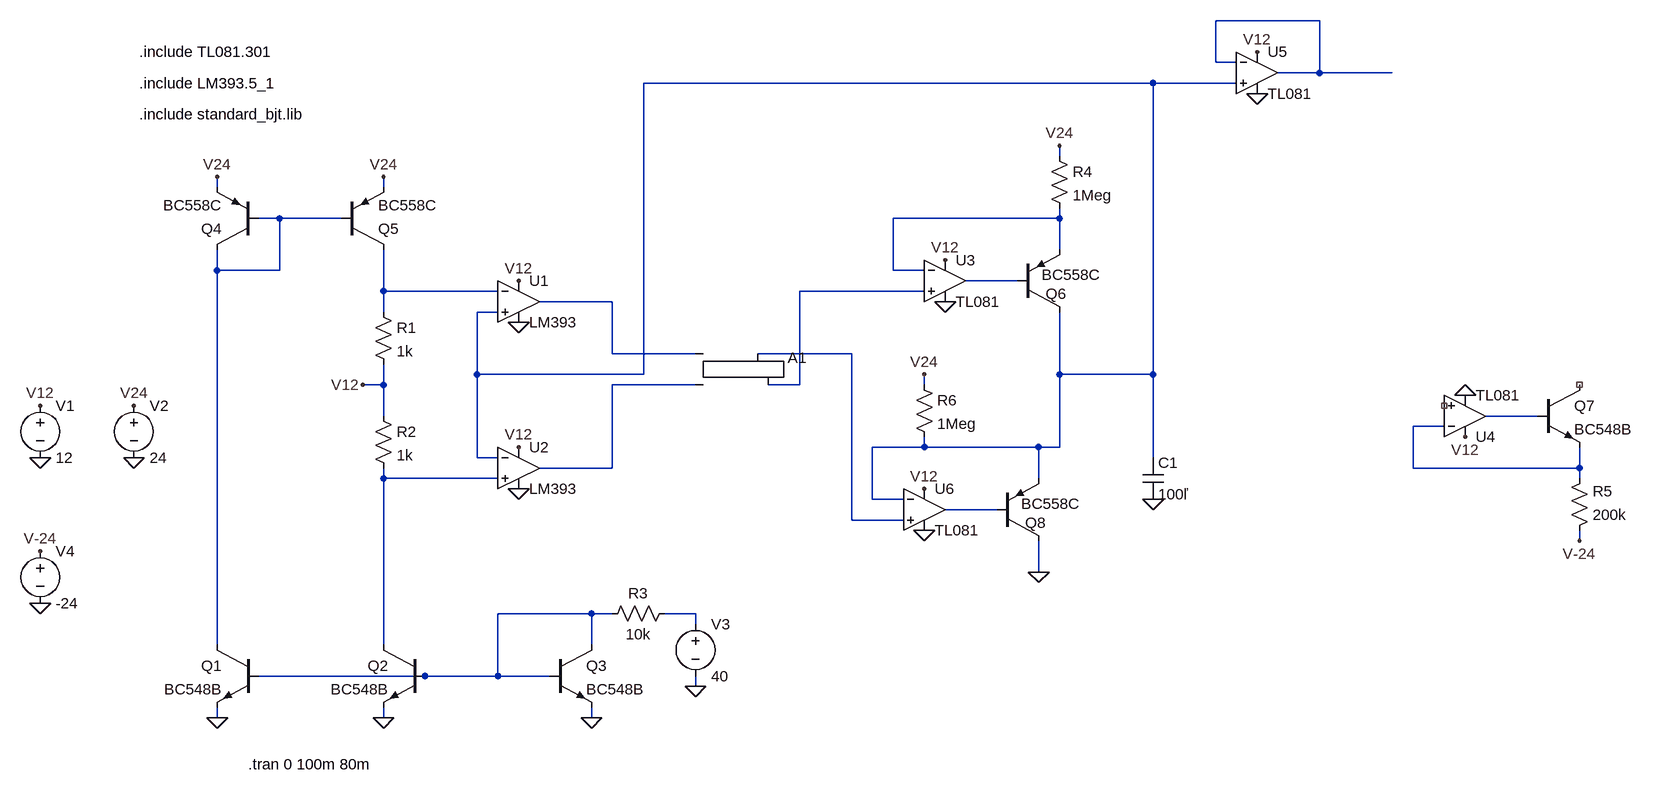
[diagram p0: schematic Gen_triangular_prueba1.asc]
Gen_triangular_prueba1.asc, the LTspice schematic file:
Version 4
SHEET 1 2312 680
WIRE 1824 -688 1664 -688
WIRE 1664 -624 1664 -688
WIRE 1696 -624 1664 -624
WIRE 1824 -608 1824 -688
WIRE 1824 -608 1760 -608
WIRE 1936 -608 1824 -608
WIRE 1568 -592 784 -592
WIRE 1696 -592 1568 -592
WIRE 1424 -480 1424 -496
WIRE 128 -432 128 -448
WIRE 384 -432 384 -448
WIRE 224 -384 192 -384
WIRE 320 -384 224 -384
WIRE 1424 -384 1424 -400
WIRE 1424 -384 1168 -384
WIRE 1424 -336 1424 -384
WIRE 128 -304 128 -336
WIRE 224 -304 224 -384
WIRE 224 -304 128 -304
WIRE 1168 -304 1168 -384
WIRE 1216 -304 1168 -304
WIRE 1360 -288 1280 -288
WIRE 384 -272 384 -336
WIRE 560 -272 384 -272
WIRE 1216 -272 1024 -272
WIRE 736 -256 624 -256
WIRE 384 -240 384 -272
WIRE 560 -240 528 -240
WIRE 736 -176 736 -256
WIRE 864 -176 736 -176
WIRE 1104 -176 960 -176
WIRE 528 -144 528 -240
WIRE 784 -144 784 -592
WIRE 784 -144 528 -144
WIRE 1424 -144 1424 -240
WIRE 1568 -144 1568 -592
WIRE 1568 -144 1424 -144
WIRE 384 -128 384 -160
WIRE 384 -128 352 -128
WIRE 864 -128 736 -128
WIRE 1024 -128 1024 -272
WIRE 1024 -128 976 -128
WIRE 1216 -128 1216 -144
WIRE 384 -80 384 -128
WIRE 2160 -80 2080 -80
WIRE 2016 -64 1968 -64
WIRE 1216 -32 1216 -48
WIRE 1216 -32 1136 -32
WIRE 1392 -32 1216 -32
WIRE 1424 -32 1424 -144
WIRE 1424 -32 1392 -32
WIRE 528 -16 528 -144
WIRE 560 -16 528 -16
WIRE 1568 -16 1568 -144
WIRE 736 0 736 -128
WIRE 736 0 624 0
WIRE 1968 0 1968 -64
WIRE 2224 0 2224 -32
WIRE 2224 0 1968 0
WIRE 384 16 384 0
WIRE 560 16 384 16
WIRE 1392 16 1392 -32
WIRE 2224 16 2224 0
WIRE 1136 48 1136 -32
WIRE 1184 48 1136 48
WIRE 1328 64 1248 64
WIRE 1104 80 1104 -176
WIRE 1184 80 1104 80
WIRE 2224 112 2224 96
WIRE 1392 160 1392 112
WIRE 704 224 560 224
WIRE 736 224 704 224
WIRE 864 224 816 224
WIRE 864 240 864 224
WIRE 128 272 128 -304
WIRE 384 272 384 16
WIRE 704 272 704 224
WIRE 448 320 192 320
WIRE 560 320 560 224
WIRE 560 320 448 320
WIRE 640 320 560 320
WIRE 864 336 864 320
WIRE 128 384 128 368
WIRE 384 384 384 368
WIRE 704 384 704 368
FLAG 704 384 0
FLAG 384 384 0
FLAG 128 384 0
FLAG 864 336 0
FLAG -144 -16 0
FLAG 0 -16 0
FLAG 352 -128 V12
FLAG -144 -96 V12
FLAG 0 -96 V24
FLAG 384 -448 V24
FLAG 128 -448 V24
FLAG 1568 48 0
FLAG 1424 -496 V24
FLAG 2224 112 V-24
FLAG 592 -224 0
FLAG 592 32 0
FLAG 592 -288 V12
FLAG 592 -32 V12
FLAG 1248 -256 0
FLAG 2048 -112 0
FLAG 1728 -576 0
FLAG 1248 -320 V12
FLAG 2048 -48 V12
FLAG 1728 -640 V12
FLAG -144 208 0
FLAG -144 128 V-24
FLAG 1216 -144 V24
FLAG 1216 96 0
FLAG 1216 32 V12
FLAG 1392 160 0
DATAFLAG 528 -272 "$-V(N002)"
DATAFLAG 528 16 "$-V(N002)"
DATAFLAG 1056 -176 ""
DATAFLAG 1008 -128 ""
DATAFLAG 736 -192 ""
DATAFLAG 736 -32 ""
SYMBOL npn 192 272 M0
SYMATTR InstName Q1
SYMATTR Value BC548B
SYMBOL npn 448 272 M0
SYMATTR InstName Q2
SYMATTR Value BC548B
SYMBOL npn 640 272 R0
SYMATTR InstName Q3
SYMATTR Value BC548B
SYMBOL pnp 192 -336 R180
SYMATTR InstName Q4
SYMATTR Value BC558C
SYMBOL pnp 320 -336 M180
SYMATTR InstName Q5
SYMATTR Value BC558C
SYMBOL res 368 -256 R0
SYMATTR InstName R1
SYMATTR Value 1k
SYMBOL res 368 -96 R0
SYMATTR InstName R2
SYMATTR Value 1k
SYMBOL res 832 208 R90
WINDOW 0 0 56 VBottom 2
WINDOW 3 32 56 VTop 2
SYMATTR InstName R3
SYMATTR Value 10k
SYMBOL voltage -144 -112 R0
WINDOW 123 0 0 Left 0
WINDOW 39 0 0 Left 0
SYMATTR InstName V1
SYMATTR Value 12
SYMBOL voltage 0 -112 R0
WINDOW 123 0 0 Left 0
WINDOW 39 0 0 Left 0
SYMATTR InstName V2
SYMATTR Value 24
SYMBOL voltage 864 224 R0
WINDOW 123 0 0 Left 0
WINDOW 39 0 0 Left 0
SYMATTR InstName V3
SYMATTR Value 40
SYMBOL Opamps\\opamp2 592 -320 R0
SYMATTR InstName U1
SYMATTR Value LM393
SYMBOL Opamps\\opamp2 592 -64 R0
SYMATTR InstName U2
SYMATTR Value LM393
SYMBOL Digital\\srflop 912 -224 R0
SYMATTR InstName A1
SYMBOL cap 1552 -16 R0
SYMATTR InstName C1
SYMATTR Value 100ľ
SYMBOL Opamps\\opamp2 1248 -352 R0
SYMATTR InstName U3
SYMATTR Value TL081
SYMBOL Opamps\\opamp2 2048 -16 M180
SYMATTR InstName U4
SYMATTR Value TL081
SYMBOL pnp 1360 -240 M180
WINDOW 0 43 28 Left 2
WINDOW 3 37 57 Left 2
SYMATTR InstName Q6
SYMATTR Value BC558C
SYMBOL res 1408 -496 R0
SYMATTR InstName R4
SYMATTR Value 1Meg
SYMBOL res 2208 112 M180
WINDOW 0 36 76 Left 2
WINDOW 3 36 40 Left 2
SYMATTR InstName R5
SYMATTR Value 200k
SYMBOL npn 2160 -128 R0
SYMATTR InstName Q7
SYMATTR Value BC548B
SYMBOL Opamps\\opamp2 1728 -672 R0
SYMATTR InstName U5
SYMATTR Value TL081
SYMBOL voltage -144 112 R0
WINDOW 123 0 0 Left 0
WINDOW 39 0 0 Left 0
SYMATTR InstName V4
SYMATTR Value -24
SYMBOL Opamps\\opamp2 1216 0 R0
SYMATTR InstName U6
SYMATTR Value TL081
SYMBOL pnp 1328 112 M180
WINDOW 0 43 28 Left 2
WINDOW 3 37 57 Left 2
SYMATTR InstName Q8
SYMATTR Value BC558C
SYMBOL res 1200 -144 R0
SYMATTR InstName R6
SYMATTR Value 1Meg
TEXT 8 -544 Left 2 !.include standard_bjt.lib
TEXT 176 456 Left 2 !.tran 0 100m 80m
TEXT 8 -592 Left 2 !.include LM393.5_1
TEXT 8 -640 Left 2 !.include TL081.301

The netlist it stands for:
* Gen_triangular_prueba1.asc
Q1 N003 N015 0 0 BC548B
Q2 N013 N015 0 0 BC548B
Q3 N015 N015 0 0 BC548B
Q4 N003 N003 V24 0 BC558C
Q5 N006 N003 V24 0 BC558C
R1 N006 V12 1k
R2 V12 N013 1k
R3 N016 N015 10k
V1 V12 0 12
V2 V24 0 24
V3 N016 0 40
XU1 N002 N006 V12 0 N008 LM393  ; pins In+ In- V+ V- OUT
XU2 N013 N002 V12 0 N010 LM393  ; pins In+ In- V+ V- OUT
A1 N008 N010 0 0 0 N007 N009 0 SRFLOP
C1 N002 0 100ľ
XU3 N007 N004 V12 0 N005 TL081  ; pins In+ In- V+ V- OUT
XU4 NC_01 N012 V12 0 N011 TL081  ; pins In+ In- V+ V- OUT
Q6 N002 N005 N004 0 BC558C
R4 V24 N004 1Meg
R5 V-24 N012 200k
Q7 NC_02 N011 N012 0 BC548B
XU5 N002 N001 V12 0 N001 TL081  ; pins In+ In- V+ V- OUT
V4 V-24 0 -24
XU6 N009 N002 V12 0 N014 TL081  ; pins In+ In- V+ V- OUT
Q8 0 N014 N002 0 BC558C
R6 V24 N002 1Meg
.model NPN NPN
.model PNP PNP
.lib standard.bjt
.include standard_bjt.lib
.tran 0 100m 80m
.include LM393.5_1
.include TL081.301
.backanno
.end